# Altium project KlusterLab r2.0.PrjPcb (part 10 of 10)
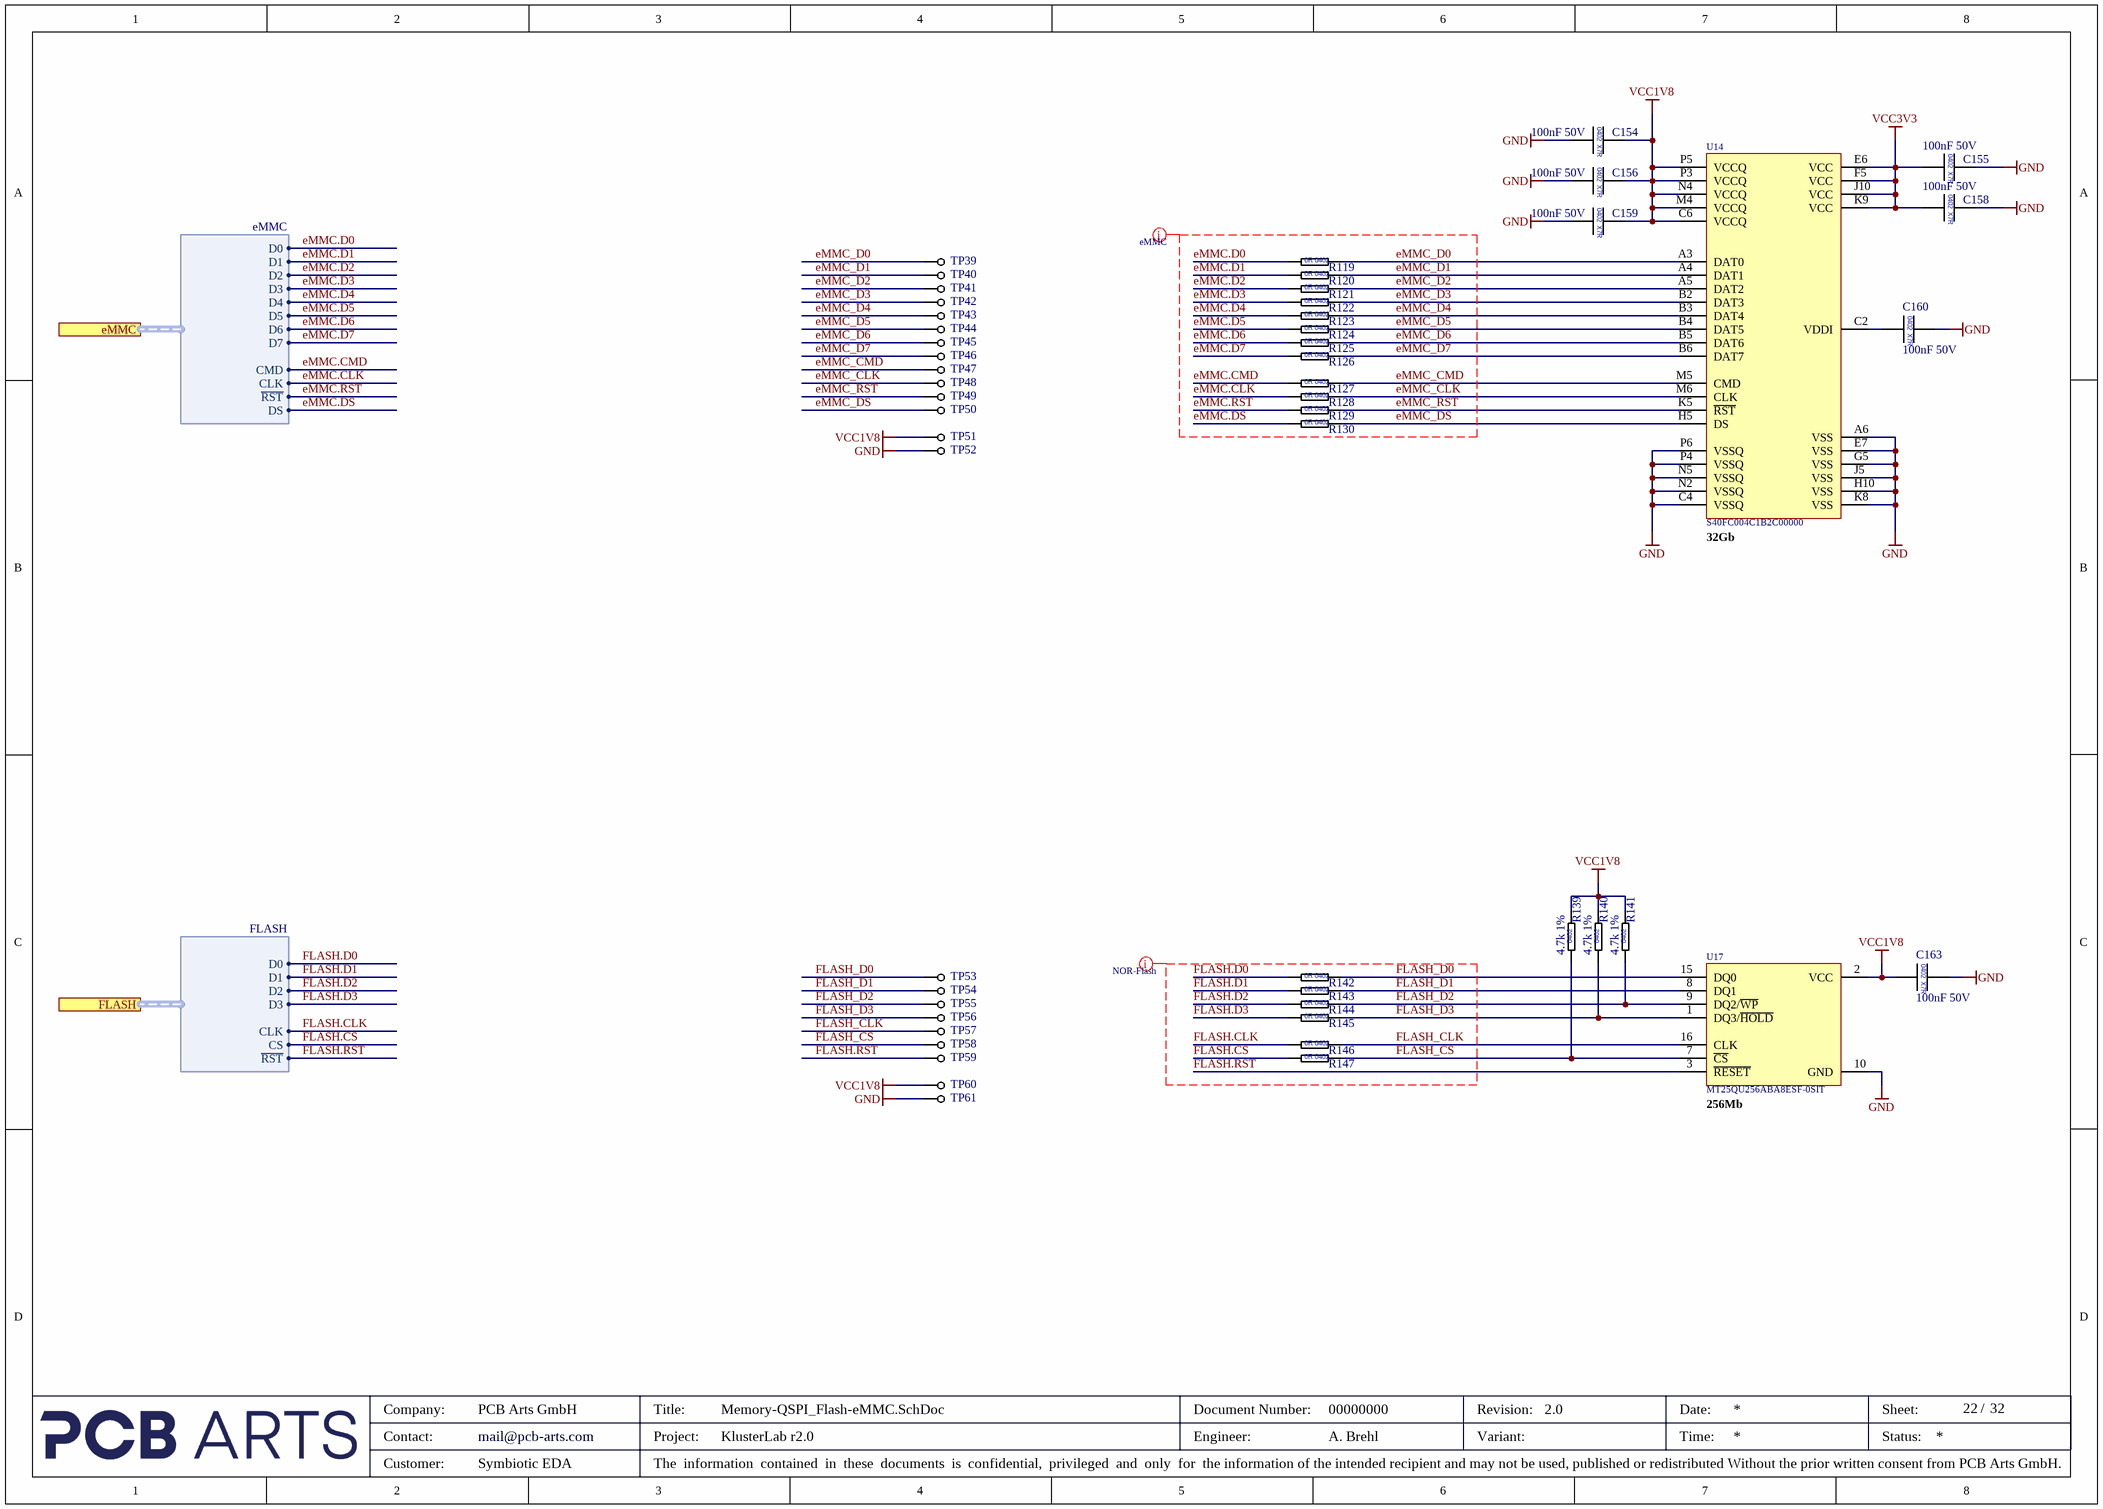
[diagram p31: Memory-QSPI_Flash-eMMC.SchDoc]

## Nets that join several sheets
CM4_3V3: Raspberry Pi CM4 (9 pins), Raspberry Pi CM4_Periphery (C116.1 J12.4 J34.10 J34.12)
GND: Bank 0_Bank 14 (37 pins), Bank 13_Bank 15_Bank 16 (5 pins), DDR3 Memory_Banks 32-33-34 (21 pins), DDR3 Memory_SO-DIMM (85 pins), FPGA_HDMI_IN_OUT (80 pins), HMI (22 pins), Raspberry Pi CM4 (60 pins), SFP+_Connectors (68 pins), SSD M.2_B-Key (16 pins), USB-HUB-MUX (32 pins), Raspberry Pi CM4_Periphery (45 pins), I2C Multiplexer (5 pins), System Clocks (30 pins), FPGA Supply Pins (186 pins), Power-Tree (20 pins), PSU_MGTAVCC_Buck (35 pins), PSU_MGTAVTT_Buck (35 pins), PSU_VCC1V0_FPGA_Buck (67 pins), PSU_VCC1V5_Buck (35 pins), PSU_VCC1V8AUX_Buck (35 pins), PSU_VCC1V8_Buck (35 pins), PSU_VCC2V5_Buck (35 pins), PSU_VCC3V3_Buck (35 pins), PSU_VCC5V_Buck (35 pins), PSU_VCC_CRUVI_ADJ_Buck (26 pins), Cruvi Pinheader (45 pins), Memory-SD_UHS_II (41 pins), Memory-QSPI_Flash-eMMC (21 pins)
MGTAVCC: FPGA Supply Pins (11 pins), PSU_MGTAVCC_Buck (14 pins)
MGTAVTT: MGT Banks 115-116 (R16.2 U1.M5), FPGA Supply Pins (16 pins), PSU_MGTAVTT_Buck (14 pins)
VCC1V0_FPGA: FPGA Supply Pins (36 pins), PSU_VCC1V0_FPGA_Buck (46 pins)
VCC1V5: DDR3 Memory_Banks 32-33-34 (8 pins), DDR3 Memory_SO-DIMM (43 pins), FPGA Supply Pins (27 pins), PSU_VCC1V5_Buck (14 pins)
VCC1V8: Bank 0_Bank 14 (14 pins), HMI (7 pins), SMI Bank 12 (Q5.1 Q6.1 R88.2 R90.2), I2C Multiplexer (8 pins), System Clocks (14 pins), FPGA Supply Pins (23 pins), PSU_VCC1V8_Buck (14 pins), Memory-SD_UHS_II (6 pins), Memory-QSPI_Flash-eMMC (15 pins)
VCC1V8_AUX: FPGA Supply Pins (17 pins), PSU_VCC1V8AUX_Buck (14 pins)
VCC2V5: DDR3 Memory_Banks 32-33-34 (U2.7), PSU_VCC2V5_Buck (14 pins)
VCC3V3: Bank 0_Bank 14 (7 pins), Bank 13_Bank 15_Bank 16 (R283.2 R284.2 R285.2 R286.2), DDR3 Memory_Banks 32-33-34 (C4.1 C5.2 U2.10), DDR3 Memory_SO-DIMM (C15.2 J1.199 R12.2 R13.2), FPGA_HDMI_IN_OUT (26 pins), HMI (J25.2 J28.4 R173.2 R174.2), Raspberry Pi CM4 (R69.2), SFP+_Connectors (40 pins), SMI Bank 12 (R87.2 R89.2), SSD M.2_B-Key (9 pins), USB-HUB-MUX (17 pins), System Clocks (14 pins), FPGA Supply Pins (10 pins), Power-Tree (5 pins), PSU_VCC3V3_Buck (14 pins), PSU_VCC_CRUVI_ADJ_Buck (R324.1), Cruvi Pinheader (J21.4 J21.9 J27.4 J27.9), Memory-SD_UHS_II (5 pins), Memory-QSPI_Flash-eMMC (6 pins)
VCC5V: Bank 13_Bank 15_Bank 16 (5 pins), FPGA_HDMI_IN_OUT (5 pins), Raspberry Pi CM4 (6 pins), USB-HUB-MUX (R73.2), Raspberry Pi CM4_Periphery (5 pins), PSU_VCC5V_Buck (14 pins), PSU_VCC_CRUVI_ADJ_Buck (8 pins), Cruvi Pinheader (J21.60 J27.60), Memory-SD_UHS_II (C531.1 C532.1 U40.3)
VCC12V: Power-Tree (7 pins), PSU_MGTAVCC_Buck (12 pins), PSU_MGTAVTT_Buck (12 pins), PSU_VCC1V0_FPGA_Buck (12 pins), PSU_VCC1V5_Buck (12 pins), PSU_VCC1V8AUX_Buck (12 pins), PSU_VCC1V8_Buck (12 pins), PSU_VCC2V5_Buck (12 pins), PSU_VCC3V3_Buck (12 pins), PSU_VCC5V_Buck (12 pins)
VCC_CRUVI_ADJ: Bank 0_Bank 14 (U11.2), Bank 13_Bank 15_Bank 16 (6 pins), FPGA Supply Pins (18 pins), PSU_VCC_CRUVI_ADJ_Buck (9 pins), Cruvi Pinheader (J21.36 J27.36)
VTTDDR: DDR3 Memory_Banks 32-33-34 (6 pins), DDR3 Memory_SO-DIMM (10 pins)
VTTVREF: DDR3 Memory_Banks 32-33-34 (11 pins), DDR3 Memory_SO-DIMM (C16.1 J1.1 J1.126)
150MHz_REFCLK_N: MGT Banks 115-116 (R18.2 U1.F5), System Clocks (Y5.5)
150MHz_REFCLK_P: MGT Banks 115-116 (R18.1 U1.F6), System Clocks (Y5.4)
156.25MHz_REFCLK_N: MGT Banks 115-116 (R19.2 U1.H5), System Clocks (Y6.5)
156.25MHz_REFCLK_P: MGT Banks 115-116 (R19.1 U1.H6), System Clocks (Y6.4)
200MHz_SYSCLK_N: DDR3 Memory_Banks 32-33-34 (R9.1 U1.AD9), System Clocks (Y4.5)
200MHz_SYSCLK_P: DDR3 Memory_Banks 32-33-34 (R9.2 U1.AC9), System Clocks (Y4.4)
Button_C: Bank 0_Bank 14 (U1.H23), HMI (C418.1 J28.5 R180.1 R185.1)
Button_D: Bank 0_Bank 14 (U1.G22), HMI (C420.1 J28.3 R187.1 R188.1)
Button_L: Bank 0_Bank 14 (U1.H22), HMI (C417.1 J28.1 R179.1 R184.1)
Button_R: Bank 0_Bank 14 (U1.H24), HMI (C419.1 J28.7 R183.1 R186.1)
Button_U: Bank 0_Bank 14 (U1.J24), HMI (C416.1 J28.9 R175.1 R178.1)
CM4_GBE_LED_G: Raspberry Pi CM4 (J7.17), Raspberry Pi CM4_Periphery (R149.1)
CM4_GBE_LED_Y: Raspberry Pi CM4 (J7.15), Raspberry Pi CM4_Periphery (R137.1)
CM4_GBE_MDI0_N: Raspberry Pi CM4 (J7.10), Raspberry Pi CM4_Periphery (T1.13)
CM4_GBE_MDI0_P: Raspberry Pi CM4 (J7.12), Raspberry Pi CM4_Periphery (T1.14)
CM4_GBE_MDI1_N: Raspberry Pi CM4 (J7.6), Raspberry Pi CM4_Periphery (T1.16)
CM4_GBE_MDI1_P: Raspberry Pi CM4 (J7.4), Raspberry Pi CM4_Periphery (T1.17)
CM4_GBE_MDI2_N: Raspberry Pi CM4 (J7.9), Raspberry Pi CM4_Periphery (T1.19)
CM4_GBE_MDI2_P: Raspberry Pi CM4 (J7.11), Raspberry Pi CM4_Periphery (T1.20)
CM4_GBE_MDI3_N: Raspberry Pi CM4 (J7.5), Raspberry Pi CM4_Periphery (T1.22)
CM4_GBE_MDI3_P: Raspberry Pi CM4 (J7.3), Raspberry Pi CM4_Periphery (T1.23)
CM4_GPIO00: Raspberry Pi CM4 (J7.36), SMI Bank 12 (U1.AB25)
CM4_GPIO01: Raspberry Pi CM4 (J7.35), SMI Bank 12 (U1.V23)
CM4_GPIO02: Raspberry Pi CM4 (J7.58), SMI Bank 12 (U1.U26)
CM4_GPIO03: Raspberry Pi CM4 (J7.56), SMI Bank 12 (U1.U24)
CM4_GPIO04: Raspberry Pi CM4 (J7.54), SMI Bank 12 (U1.V26)
CM4_GPIO05: Raspberry Pi CM4 (J7.34), SMI Bank 12 (U1.AB26)
CM4_GPIO06: Raspberry Pi CM4 (J7.30), SMI Bank 12 (U1.AC24)
CM4_GPIO07: Raspberry Pi CM4 (J7.37), SMI Bank 12 (U1.W23)
CM4_GPIO08: Raspberry Pi CM4 (J7.39), SMI Bank 12 (U1.W24)
CM4_GPIO09: Raspberry Pi CM4 (J7.40), SMI Bank 12 (U1.Y26)
CM4_GPIO10: Raspberry Pi CM4 (J7.44), SMI Bank 12 (U1.Y25)
CM4_GPIO11: Raspberry Pi CM4 (J7.38), SMI Bank 12 (U1.AA25)
CM4_GPIO12: Raspberry Pi CM4 (J7.31), SMI Bank 12 (U1.U22)
CM4_GPIO13: Raspberry Pi CM4 (J7.28), SMI Bank 12 (U1.AC26)
CM4_GPIO14: Raspberry Pi CM4 (J7.55), SMI Bank 12 (U1.U25)
CM4_GPIO15: Raspberry Pi CM4 (J7.51), SMI Bank 12 (U1.W26)
CM4_GPIO16: Raspberry Pi CM4 (J7.29), SMI Bank 12 (U1.Y22)
CM4_GPIO17: Raspberry Pi CM4 (J7.50), SMI Bank 12 (U1.W25)
CM4_GPIO18: Raspberry Pi CM4 (J7.49), SMI Bank 12 (U1.Y23)
CM4_GPIO19: Raspberry Pi CM4 (J7.26), SMI Bank 12 (U1.AC23)
CM4_GPIO20: Raspberry Pi CM4 (J7.27), SMI Bank 12 (U1.Y21)
CM4_GPIO21: Raspberry Pi CM4 (J7.25), SMI Bank 12 (U1.W20)
CM4_GPIO22: Raspberry Pi CM4 (J7.46), SMI Bank 12 (U1.AB24)
CM4_GPIO23: Raspberry Pi CM4 (J7.47), SMI Bank 12 (U1.AA23)
CM4_GPIO24: Raspberry Pi CM4 (J7.45), SMI Bank 12 (U1.AA24)
CM4_GPIO25: Raspberry Pi CM4 (J7.41), SMI Bank 12 (U1.AD21)
CM4_GPIO26: Raspberry Pi CM4 (J7.24), SMI Bank 12 (U1.AF24)
CM4_GPIO27: Raspberry Pi CM4 (J7.48), SMI Bank 12 (U1.AF25)
CM4_OTG_ID: Raspberry Pi CM4 (J8.101), USB-HUB-MUX (U10.2)
CM4_USB_N: Raspberry Pi CM4 (J8.103), USB-HUB-MUX (U10.4)
CM4_USB_P: Raspberry Pi CM4 (J8.105), USB-HUB-MUX (U10.3)
CM4_µSD_CLK: Raspberry Pi CM4 (J7.57), Raspberry Pi CM4_Periphery (D20.2 J12.5)
CM4_µSD_CMD: Raspberry Pi CM4 (J7.62), Raspberry Pi CM4_Periphery (D21.2 J12.3)
CM4_µSD_DAT0: Raspberry Pi CM4 (J7.63), Raspberry Pi CM4_Periphery (D16.2 J12.7)
CM4_µSD_DAT1: Raspberry Pi CM4 (J7.67), Raspberry Pi CM4_Periphery (D17.2 J12.8)
CM4_µSD_DAT2: Raspberry Pi CM4 (J7.69), Raspberry Pi CM4_Periphery (D18.2 J12.1)
CM4_µSD_DAT3: Raspberry Pi CM4 (J7.61), Raspberry Pi CM4_Periphery (D19.2 J12.2)
CRUVI_A_0_N: Bank 13_Bank 15_Bank 16 (U1.F8), Cruvi Pinheader (J21.17)
CRUVI_A_0_P: Bank 13_Bank 15_Bank 16 (U1.F9), Cruvi Pinheader (J21.15)
CRUVI_A_1_N: Bank 13_Bank 15_Bank 16 (U1.A14), Cruvi Pinheader (J21.23)
CRUVI_A_1_P: Bank 13_Bank 15_Bank 16 (U1.B14), Cruvi Pinheader (J21.21)
CRUVI_A_2_N: Bank 13_Bank 15_Bank 16 (U1.A15), Cruvi Pinheader (J21.29)
CRUVI_A_2_P: Bank 13_Bank 15_Bank 16 (U1.B15), Cruvi Pinheader (J21.27)
CRUVI_A_3_N: Bank 13_Bank 15_Bank 16 (U1.C13), Cruvi Pinheader (J21.35)
CRUVI_A_3_P: Bank 13_Bank 15_Bank 16 (U1.C14), Cruvi Pinheader (J21.33)
CRUVI_A_4_N: Bank 13_Bank 15_Bank 16 (U1.D13), Cruvi Pinheader (J21.41)
CRUVI_A_4_P: Bank 13_Bank 15_Bank 16 (U1.D14), Cruvi Pinheader (J21.39)
CRUVI_A_5_N: Bank 13_Bank 15_Bank 16 (U1.G14), Cruvi Pinheader (J21.47)
CRUVI_A_5_P: Bank 13_Bank 15_Bank 16 (U1.H14), Cruvi Pinheader (J21.45)
CRUVI_A_6_N: Bank 13_Bank 15_Bank 16 (U1.D10), Cruvi Pinheader (J21.16)
CRUVI_A_6_P: Bank 13_Bank 15_Bank 16 (U1.E10), Cruvi Pinheader (J21.14)
CRUVI_A_7_N: Bank 13_Bank 15_Bank 16 (U1.D11), Cruvi Pinheader (J21.22)
CRUVI_A_7_P: Bank 13_Bank 15_Bank 16 (U1.E11), Cruvi Pinheader (J21.20)
CRUVI_A_8_N: Bank 13_Bank 15_Bank 16 (U1.B11), Cruvi Pinheader (J21.28)
CRUVI_A_8_P: Bank 13_Bank 15_Bank 16 (U1.B12), Cruvi Pinheader (J21.26)
CRUVI_A_9_N: Bank 13_Bank 15_Bank 16 (U1.F13), Cruvi Pinheader (J21.34)
CRUVI_A_9_P: Bank 13_Bank 15_Bank 16 (U1.F14), Cruvi Pinheader (J21.32)
CRUVI_A_10_N: Bank 13_Bank 15_Bank 16 (U1.A12), Cruvi Pinheader (J21.40)
CRUVI_A_10_P: Bank 13_Bank 15_Bank 16 (U1.A13), Cruvi Pinheader (J21.38)
CRUVI_A_11_N: Bank 13_Bank 15_Bank 16 (U1.D8), Cruvi Pinheader (J21.46)
CRUVI_A_11_P: Bank 13_Bank 15_Bank 16 (U1.D9), Cruvi Pinheader (J21.44)
CRUVI_A_DI: Bank 13_Bank 15_Bank 16 (U1.G19), Cruvi Pinheader (J21.51)
CRUVI_A_DO: Bank 13_Bank 15_Bank 16 (U1.D20), Cruvi Pinheader (J21.53)
CRUVI_A_HSI: Bank 13_Bank 15_Bank 16 (U1.F17), Cruvi Pinheader (J21.10)
CRUVI_A_HSIO: Bank 13_Bank 15_Bank 16 (U1.H18), Cruvi Pinheader (J21.2)
CRUVI_A_HSO: Bank 13_Bank 15_Bank 16 (U1.H17), Cruvi Pinheader (J21.6)
CRUVI_A_MODE: Bank 13_Bank 15_Bank 16 (U1.F20), Cruvi Pinheader (J21.57)
CRUVI_A_REFCLK: Bank 13_Bank 15_Bank 16 (U1.E17), Cruvi Pinheader (J21.11)
CRUVI_A_RESET: Bank 13_Bank 15_Bank 16 (U1.H16), Cruvi Pinheader (J21.8)
CRUVI_A_SCK: Bank 13_Bank 15_Bank 16 (U1.G20), Cruvi Pinheader (J21.59)
CRUVI_A_SEL: Bank 13_Bank 15_Bank 16 (U1.E20), Cruvi Pinheader (J21.55)
CRUVI_A_SMB_ALERT: Bank 13_Bank 15_Bank 16 (U1.H19), Cruvi Pinheader (J21.3)
CRUVI_A_SMB_SCL: Bank 13_Bank 15_Bank 16 (R285.1 U1.G17), Cruvi Pinheader (J21.7)
CRUVI_A_SMB_SDA: Bank 13_Bank 15_Bank 16 (R283.1 U1.F19), Cruvi Pinheader (J21.5)
CRUVI_B_0_N: Bank 13_Bank 15_Bank 16 (U1.A8), Cruvi Pinheader (J27.17)
CRUVI_B_0_P: Bank 13_Bank 15_Bank 16 (U1.A9), Cruvi Pinheader (J27.15)
CRUVI_B_1_N: Bank 13_Bank 15_Bank 16 (U1.A10), Cruvi Pinheader (J27.23)
CRUVI_B_1_P: Bank 13_Bank 15_Bank 16 (U1.B10), Cruvi Pinheader (J27.21)
CRUVI_B_2_N: Bank 13_Bank 15_Bank 16 (U1.F12), Cruvi Pinheader (J27.29)
CRUVI_B_2_P: Bank 13_Bank 15_Bank 16 (U1.G12), Cruvi Pinheader (J27.27)
CRUVI_B_3_N: Bank 13_Bank 15_Bank 16 (U1.E12), Cruvi Pinheader (J27.35)
CRUVI_B_3_P: Bank 13_Bank 15_Bank 16 (U1.E13), Cruvi Pinheader (J27.33)
CRUVI_B_4_N: Bank 13_Bank 15_Bank 16 (U1.H13), Cruvi Pinheader (J27.41)
CRUVI_B_4_P: Bank 13_Bank 15_Bank 16 (U1.J13), Cruvi Pinheader (J27.39)
CRUVI_B_5_N: Bank 13_Bank 15_Bank 16 (U1.H11), Cruvi Pinheader (J27.47)
CRUVI_B_5_P: Bank 13_Bank 15_Bank 16 (U1.H12), Cruvi Pinheader (J27.45)
CRUVI_B_6_N: Bank 13_Bank 15_Bank 16 (U1.F10), Cruvi Pinheader (J27.16)
CRUVI_B_6_P: Bank 13_Bank 15_Bank 16 (U1.G11), Cruvi Pinheader (J27.14)
CRUVI_B_7_N: Bank 13_Bank 15_Bank 16 (U1.C11), Cruvi Pinheader (J27.22)
CRUVI_B_7_P: Bank 13_Bank 15_Bank 16 (U1.C12), Cruvi Pinheader (J27.20)
CRUVI_B_8_N: Bank 13_Bank 15_Bank 16 (U1.B9), Cruvi Pinheader (J27.28)
CRUVI_B_8_P: Bank 13_Bank 15_Bank 16 (U1.C9), Cruvi Pinheader (J27.26)
CRUVI_B_9_N: Bank 13_Bank 15_Bank 16 (U1.J10), Cruvi Pinheader (J27.34)
CRUVI_B_9_P: Bank 13_Bank 15_Bank 16 (U1.J11), Cruvi Pinheader (J27.32)
CRUVI_B_10_N: Bank 13_Bank 15_Bank 16 (U1.H8), Cruvi Pinheader (J27.40)
CRUVI_B_10_P: Bank 13_Bank 15_Bank 16 (U1.H9), Cruvi Pinheader (J27.38)
CRUVI_B_11_N: Bank 13_Bank 15_Bank 16 (U1.G9), Cruvi Pinheader (J27.46)
CRUVI_B_11_P: Bank 13_Bank 15_Bank 16 (U1.G10), Cruvi Pinheader (J27.44)
CRUVI_B_DI: Bank 13_Bank 15_Bank 16 (U1.J15), Cruvi Pinheader (J27.51)
CRUVI_B_DO: Bank 13_Bank 15_Bank 16 (U1.C18), Cruvi Pinheader (J27.53)
CRUVI_B_HSI: Bank 13_Bank 15_Bank 16 (U1.G16), Cruvi Pinheader (J27.10)
CRUVI_B_HSIO: Bank 13_Bank 15_Bank 16 (U1.F15), Cruvi Pinheader (J27.2)
CRUVI_B_HSO: Bank 13_Bank 15_Bank 16 (U1.D16), Cruvi Pinheader (J27.6)
CRUVI_B_MODE: Bank 13_Bank 15_Bank 16 (U1.E18), Cruvi Pinheader (J27.57)
CRUVI_B_REFCLK: Bank 13_Bank 15_Bank 16 (U1.E16), Cruvi Pinheader (J27.11)
CRUVI_B_RESET: Bank 13_Bank 15_Bank 16 (U1.D15), Cruvi Pinheader (J27.8)
CRUVI_B_SCK: Bank 13_Bank 15_Bank 16 (U1.D19), Cruvi Pinheader (J27.59)
CRUVI_B_SEL: Bank 13_Bank 15_Bank 16 (U1.D18), Cruvi Pinheader (J27.55)
CRUVI_B_SMB_ALERT: Bank 13_Bank 15_Bank 16 (U1.G15), Cruvi Pinheader (J27.3)
CRUVI_B_SMB_SCL: Bank 13_Bank 15_Bank 16 (R286.1 U1.E15), Cruvi Pinheader (J27.7)
CRUVI_B_SMB_SDA: Bank 13_Bank 15_Bank 16 (R284.1 U1.J16), Cruvi Pinheader (J27.5)
DDR3_A0: DDR3 Memory_Banks 32-33-34 (U1.AF7), DDR3 Memory_SO-DIMM (J1.98)
DDR3_A1: DDR3 Memory_Banks 32-33-34 (U1.AD8), DDR3 Memory_SO-DIMM (J1.97)
DDR3_A2: DDR3 Memory_Banks 32-33-34 (U1.AB10), DDR3 Memory_SO-DIMM (J1.96)
DDR3_A3: DDR3 Memory_Banks 32-33-34 (U1.AC8), DDR3 Memory_SO-DIMM (J1.95)
DDR3_A4: DDR3 Memory_Banks 32-33-34 (U1.W11), DDR3 Memory_SO-DIMM (J1.92)
DDR3_A5: DDR3 Memory_Banks 32-33-34 (U1.AA12), DDR3 Memory_SO-DIMM (J1.91)
DDR3_A6: DDR3 Memory_Banks 32-33-34 (U1.AC12), DDR3 Memory_SO-DIMM (J1.90)
DDR3_A7: DDR3 Memory_Banks 32-33-34 (U1.AD13), DDR3 Memory_SO-DIMM (J1.86)
DDR3_A8: DDR3 Memory_Banks 32-33-34 (U1.AB12), DDR3 Memory_SO-DIMM (J1.89)
DDR3_A9: DDR3 Memory_Banks 32-33-34 (U1.AD11), DDR3 Memory_SO-DIMM (J1.85)
DDR3_A10: DDR3 Memory_Banks 32-33-34 (U1.AE7), DDR3 Memory_SO-DIMM (J1.107)
DDR3_A11: DDR3 Memory_Banks 32-33-34 (U1.Y11), DDR3 Memory_SO-DIMM (J1.84)
DDR3_A12: DDR3 Memory_Banks 32-33-34 (U1.AA13), DDR3 Memory_SO-DIMM (J1.83)
DDR3_A13: DDR3 Memory_Banks 32-33-34 (U1.AB7), DDR3 Memory_SO-DIMM (J1.119)
DDR3_A14: DDR3 Memory_Banks 32-33-34 (U1.Y13), DDR3 Memory_SO-DIMM (J1.80)
DDR3_A15: DDR3 Memory_Banks 32-33-34 (U1.Y12), DDR3 Memory_SO-DIMM (J1.78)
DDR3_BA0: DDR3 Memory_Banks 32-33-34 (U1.AC7), DDR3 Memory_SO-DIMM (J1.109)
DDR3_BA1: DDR3 Memory_Banks 32-33-34 (U1.V8), DDR3 Memory_SO-DIMM (J1.108)
DDR3_BA2: DDR3 Memory_Banks 32-33-34 (U1.AC13), DDR3 Memory_SO-DIMM (J1.79)
DDR3_~{CAS}: DDR3 Memory_Banks 32-33-34 (U1.AA7), DDR3 Memory_SO-DIMM (J1.115)
DDR3_CKE0: DDR3 Memory_Banks 32-33-34 (U1.Y10), DDR3 Memory_SO-DIMM (J1.73 R10.2)
DDR3_CKE1: DDR3 Memory_Banks 32-33-34 (U1.W9), DDR3 Memory_SO-DIMM (J1.74 R11.2)
DDR3_CLK0_N: DDR3 Memory_Banks 32-33-34 (U1.AC11), DDR3 Memory_SO-DIMM (J1.103)
DDR3_CLK0_P: DDR3 Memory_Banks 32-33-34 (U1.AB11), DDR3 Memory_SO-DIMM (J1.101)
DDR3_CLK1_N: DDR3 Memory_Banks 32-33-34 (U1.AB9), DDR3 Memory_SO-DIMM (J1.104)
DDR3_CLK1_P: DDR3 Memory_Banks 32-33-34 (U1.AA9), DDR3 Memory_SO-DIMM (J1.102)
DDR3_D0: DDR3 Memory_Banks 32-33-34 (U1.AB17), DDR3 Memory_SO-DIMM (J1.5)
DDR3_D1: DDR3 Memory_Banks 32-33-34 (U1.AC18), DDR3 Memory_SO-DIMM (J1.7)
DDR3_D2: DDR3 Memory_Banks 32-33-34 (U1.AC17), DDR3 Memory_SO-DIMM (J1.15)
DDR3_D3: DDR3 Memory_Banks 32-33-34 (U1.AD19), DDR3 Memory_SO-DIMM (J1.17)
DDR3_D4: DDR3 Memory_Banks 32-33-34 (U1.AA19), DDR3 Memory_SO-DIMM (J1.4)
DDR3_D5: DDR3 Memory_Banks 32-33-34 (U1.AA20), DDR3 Memory_SO-DIMM (J1.6)
DDR3_D6: DDR3 Memory_Banks 32-33-34 (U1.AD18), DDR3 Memory_SO-DIMM (J1.16)
DDR3_D7: DDR3 Memory_Banks 32-33-34 (U1.AC16), DDR3 Memory_SO-DIMM (J1.18)
DDR3_D8: DDR3 Memory_Banks 32-33-34 (U1.V16), DDR3 Memory_SO-DIMM (J1.21)
DDR3_D9: DDR3 Memory_Banks 32-33-34 (U1.V18), DDR3 Memory_SO-DIMM (J1.23)
DDR3_D10: DDR3 Memory_Banks 32-33-34 (U1.AB20), DDR3 Memory_SO-DIMM (J1.33)
DDR3_D11: DDR3 Memory_Banks 32-33-34 (U1.AB19), DDR3 Memory_SO-DIMM (J1.35)
DDR3_D12: DDR3 Memory_Banks 32-33-34 (U1.W15), DDR3 Memory_SO-DIMM (J1.22)
DDR3_D13: DDR3 Memory_Banks 32-33-34 (U1.V19), DDR3 Memory_SO-DIMM (J1.24)
DDR3_D14: DDR3 Memory_Banks 32-33-34 (U1.W16), DDR3 Memory_SO-DIMM (J1.34)
DDR3_D15: DDR3 Memory_Banks 32-33-34 (U1.Y17), DDR3 Memory_SO-DIMM (J1.36)
DDR3_D16: DDR3 Memory_Banks 32-33-34 (U1.AF19), DDR3 Memory_SO-DIMM (J1.39)
DDR3_D17: DDR3 Memory_Banks 32-33-34 (U1.AE17), DDR3 Memory_SO-DIMM (J1.41)
DDR3_D18: DDR3 Memory_Banks 32-33-34 (U1.AE15), DDR3 Memory_SO-DIMM (J1.51)
DDR3_D19: DDR3 Memory_Banks 32-33-34 (U1.AF15), DDR3 Memory_SO-DIMM (J1.53)
DDR3_D20: DDR3 Memory_Banks 32-33-34 (U1.AF20), DDR3 Memory_SO-DIMM (J1.40)
DDR3_D21: DDR3 Memory_Banks 32-33-34 (U1.AD16), DDR3 Memory_SO-DIMM (J1.42)
DDR3_D22: DDR3 Memory_Banks 32-33-34 (U1.AD15), DDR3 Memory_SO-DIMM (J1.50)
DDR3_D23: DDR3 Memory_Banks 32-33-34 (U1.AF14), DDR3 Memory_SO-DIMM (J1.52)
DDR3_D24: DDR3 Memory_Banks 32-33-34 (U1.AA15), DDR3 Memory_SO-DIMM (J1.57)
DDR3_D25: DDR3 Memory_Banks 32-33-34 (U1.AB16), DDR3 Memory_SO-DIMM (J1.59)
DDR3_D26: DDR3 Memory_Banks 32-33-34 (U1.AD14), DDR3 Memory_SO-DIMM (J1.67)
DDR3_D27: DDR3 Memory_Banks 32-33-34 (U1.AB14), DDR3 Memory_SO-DIMM (J1.69)
DDR3_D28: DDR3 Memory_Banks 32-33-34 (U1.AA18), DDR3 Memory_SO-DIMM (J1.56)
DDR3_D29: DDR3 Memory_Banks 32-33-34 (U1.AA17), DDR3 Memory_SO-DIMM (J1.58)
DDR3_D30: DDR3 Memory_Banks 32-33-34 (U1.AB15), DDR3 Memory_SO-DIMM (J1.68)
DDR3_D31: DDR3 Memory_Banks 32-33-34 (U1.AC14), DDR3 Memory_SO-DIMM (J1.70)
DDR3_D32: DDR3 Memory_Banks 32-33-34 (U1.AD6), DDR3 Memory_SO-DIMM (J1.129)
DDR3_D33: DDR3 Memory_Banks 32-33-34 (U1.AC6), DDR3 Memory_SO-DIMM (J1.131)
DDR3_D34: DDR3 Memory_Banks 32-33-34 (U1.AC3), DDR3 Memory_SO-DIMM (J1.141)
DDR3_D35: DDR3 Memory_Banks 32-33-34 (U1.AB4), DDR3 Memory_SO-DIMM (J1.143)
DDR3_D36: DDR3 Memory_Banks 32-33-34 (U1.AB6), DDR3 Memory_SO-DIMM (J1.130)
DDR3_D37: DDR3 Memory_Banks 32-33-34 (U1.Y6), DDR3 Memory_SO-DIMM (J1.132)
DDR3_D38: DDR3 Memory_Banks 32-33-34 (U1.Y5), DDR3 Memory_SO-DIMM (J1.140)
DDR3_D39: DDR3 Memory_Banks 32-33-34 (U1.AA4), DDR3 Memory_SO-DIMM (J1.142)
DDR3_D40: DDR3 Memory_Banks 32-33-34 (U1.AF3), DDR3 Memory_SO-DIMM (J1.147)
DDR3_D41: DDR3 Memory_Banks 32-33-34 (U1.AE3), DDR3 Memory_SO-DIMM (J1.149)
DDR3_D42: DDR3 Memory_Banks 32-33-34 (U1.AE2), DDR3 Memory_SO-DIMM (J1.157)
DDR3_D43: DDR3 Memory_Banks 32-33-34 (U1.AE1), DDR3 Memory_SO-DIMM (J1.159)
DDR3_D44: DDR3 Memory_Banks 32-33-34 (U1.AE6), DDR3 Memory_SO-DIMM (J1.146)
DDR3_D45: DDR3 Memory_Banks 32-33-34 (U1.AE5), DDR3 Memory_SO-DIMM (J1.148)
DDR3_D46: DDR3 Memory_Banks 32-33-34 (U1.AD4), DDR3 Memory_SO-DIMM (J1.158)
DDR3_D47: DDR3 Memory_Banks 32-33-34 (U1.AD1), DDR3 Memory_SO-DIMM (J1.160)
DDR3_D48: DDR3 Memory_Banks 32-33-34 (U1.W3), DDR3 Memory_SO-DIMM (J1.163)
DDR3_D49: DDR3 Memory_Banks 32-33-34 (U1.V4), DDR3 Memory_SO-DIMM (J1.165)
DDR3_D50: DDR3 Memory_Banks 32-33-34 (U1.U2), DDR3 Memory_SO-DIMM (J1.175)
DDR3_D51: DDR3 Memory_Banks 32-33-34 (U1.U5), DDR3 Memory_SO-DIMM (J1.177)
DDR3_D52: DDR3 Memory_Banks 32-33-34 (U1.V6), DDR3 Memory_SO-DIMM (J1.164)
DDR3_D53: DDR3 Memory_Banks 32-33-34 (U1.V3), DDR3 Memory_SO-DIMM (J1.166)
DDR3_D54: DDR3 Memory_Banks 32-33-34 (U1.U1), DDR3 Memory_SO-DIMM (J1.174)
DDR3_D55: DDR3 Memory_Banks 32-33-34 (U1.U6), DDR3 Memory_SO-DIMM (J1.176)
DDR3_D56: DDR3 Memory_Banks 32-33-34 (U1.AB2), DDR3 Memory_SO-DIMM (J1.181)
DDR3_D57: DDR3 Memory_Banks 32-33-34 (U1.AA3), DDR3 Memory_SO-DIMM (J1.183)
DDR3_D58: DDR3 Memory_Banks 32-33-34 (U1.W1), DDR3 Memory_SO-DIMM (J1.191)
DDR3_D59: DDR3 Memory_Banks 32-33-34 (U1.V2), DDR3 Memory_SO-DIMM (J1.193)
DDR3_D60: DDR3 Memory_Banks 32-33-34 (U1.AC2), DDR3 Memory_SO-DIMM (J1.180)
DDR3_D61: DDR3 Memory_Banks 32-33-34 (U1.Y3), DDR3 Memory_SO-DIMM (J1.182)
DDR3_D62: DDR3 Memory_Banks 32-33-34 (U1.Y2), DDR3 Memory_SO-DIMM (J1.192)
DDR3_D63: DDR3 Memory_Banks 32-33-34 (U1.V1), DDR3 Memory_SO-DIMM (J1.194)
DDR3_DM0: DDR3 Memory_Banks 32-33-34 (U1.AC19), DDR3 Memory_SO-DIMM (J1.11)
DDR3_DM1: DDR3 Memory_Banks 32-33-34 (U1.V17), DDR3 Memory_SO-DIMM (J1.28)
DDR3_DM2: DDR3 Memory_Banks 32-33-34 (U1.AF17), DDR3 Memory_SO-DIMM (J1.46)
DDR3_DM3: DDR3 Memory_Banks 32-33-34 (U1.AA14), DDR3 Memory_SO-DIMM (J1.63)
DDR3_DM4: DDR3 Memory_Banks 32-33-34 (U1.AC4), DDR3 Memory_SO-DIMM (J1.136)
DDR3_DM5: DDR3 Memory_Banks 32-33-34 (U1.AF2), DDR3 Memory_SO-DIMM (J1.153)
DDR3_DM6: DDR3 Memory_Banks 32-33-34 (U1.U7), DDR3 Memory_SO-DIMM (J1.170)
DDR3_DM7: DDR3 Memory_Banks 32-33-34 (U1.Y1), DDR3 Memory_SO-DIMM (J1.187)
DDR3_DQS0_N: DDR3 Memory_Banks 32-33-34 (U1.AE20), DDR3 Memory_SO-DIMM (J1.10)
DDR3_DQS0_P: DDR3 Memory_Banks 32-33-34 (U1.AD20), DDR3 Memory_SO-DIMM (J1.12)
DDR3_DQS1_N: DDR3 Memory_Banks 32-33-34 (U1.W19), DDR3 Memory_SO-DIMM (J1.27)
DDR3_DQS1_P: DDR3 Memory_Banks 32-33-34 (U1.W18), DDR3 Memory_SO-DIMM (J1.29)
DDR3_DQS2_N: DDR3 Memory_Banks 32-33-34 (U1.AF18), DDR3 Memory_SO-DIMM (J1.45)
DDR3_DQS2_P: DDR3 Memory_Banks 32-33-34 (U1.AE18), DDR3 Memory_SO-DIMM (J1.47)
DDR3_DQS3_N: DDR3 Memory_Banks 32-33-34 (U1.Y16), DDR3 Memory_SO-DIMM (J1.62)
DDR3_DQS3_P: DDR3 Memory_Banks 32-33-34 (U1.Y15), DDR3 Memory_SO-DIMM (J1.64)
DDR3_DQS4_N: DDR3 Memory_Banks 32-33-34 (U1.AB5), DDR3 Memory_SO-DIMM (J1.135)
DDR3_DQS4_P: DDR3 Memory_Banks 32-33-34 (U1.AA5), DDR3 Memory_SO-DIMM (J1.137)
DDR3_DQS5_N: DDR3 Memory_Banks 32-33-34 (U1.AF4), DDR3 Memory_SO-DIMM (J1.152)
DDR3_DQS5_P: DDR3 Memory_Banks 32-33-34 (U1.AF5), DDR3 Memory_SO-DIMM (J1.154)
DDR3_DQS6_N: DDR3 Memory_Banks 32-33-34 (U1.W5), DDR3 Memory_SO-DIMM (J1.169)
DDR3_DQS6_P: DDR3 Memory_Banks 32-33-34 (U1.W6), DDR3 Memory_SO-DIMM (J1.171)
DDR3_DQS7_N: DDR3 Memory_Banks 32-33-34 (U1.AC1), DDR3 Memory_SO-DIMM (J1.186)
DDR3_DQS7_P: DDR3 Memory_Banks 32-33-34 (U1.AB1), DDR3 Memory_SO-DIMM (J1.188)
DDR3_~{EVENT}: DDR3 Memory_Banks 32-33-34 (U1.W10), DDR3 Memory_SO-DIMM (J1.198 R14.1)
DDR3_ODT0: DDR3 Memory_Banks 32-33-34 (U1.AA8), DDR3 Memory_SO-DIMM (J1.116)
DDR3_ODT1: DDR3 Memory_Banks 32-33-34 (U1.V9), DDR3 Memory_SO-DIMM (J1.120)
DDR3_~{RAS}: DDR3 Memory_Banks 32-33-34 (U1.AA10), DDR3 Memory_SO-DIMM (J1.110)
DDR3_~{RESET}: DDR3 Memory_Banks 32-33-34 (U1.V11), DDR3 Memory_SO-DIMM (J1.30 R15.1)
DDR3_~{S0}: DDR3 Memory_Banks 32-33-34 (U1.Y8), DDR3 Memory_SO-DIMM (J1.114)
DDR3_~{S1}: DDR3 Memory_Banks 32-33-34 (U1.V7), DDR3 Memory_SO-DIMM (J1.121)
DDR3_SCL: DDR3 Memory_SO-DIMM (J1.202 R13.1), I2C Multiplexer (U22.4)
DDR3_SDA: DDR3 Memory_SO-DIMM (J1.200 R12.1), I2C Multiplexer (U22.3)
DDR3_~{WE}: DDR3 Memory_Banks 32-33-34 (U1.Y7), DDR3 Memory_SO-DIMM (J1.113)
eMMC.CLK: Bank 0_Bank 14 (U1.D23), Memory-QSPI_Flash-eMMC (R128.1)
eMMC.CMD: Bank 0_Bank 14 (U1.E22), Memory-QSPI_Flash-eMMC (R127.1)
eMMC.D0: Bank 0_Bank 14 (U1.A24), Memory-QSPI_Flash-eMMC (R119.1)
eMMC.D1: Bank 0_Bank 14 (U1.A23), Memory-QSPI_Flash-eMMC (R120.1)
eMMC.D2: Bank 0_Bank 14 (U1.C26), Memory-QSPI_Flash-eMMC (R121.1)
eMMC.D3: Bank 0_Bank 14 (U1.D21), Memory-QSPI_Flash-eMMC (R122.1)
eMMC.D4: Bank 0_Bank 14 (U1.C24), Memory-QSPI_Flash-eMMC (R123.1)
eMMC.D5: Bank 0_Bank 14 (U1.C21), Memory-QSPI_Flash-eMMC (R124.1)
eMMC.D6: Bank 0_Bank 14 (U1.D24), Memory-QSPI_Flash-eMMC (R125.1)
eMMC.D7: Bank 0_Bank 14 (U1.B21), Memory-QSPI_Flash-eMMC (R126.1)
eMMC.DS: Bank 0_Bank 14 (U1.F22), Memory-QSPI_Flash-eMMC (R130.1)
eMMC.~{RST}: Bank 0_Bank 14 (U1.D26), Memory-QSPI_Flash-eMMC (R129.1)
FLASH.~{CS}: Bank 0_Bank 14 (U1.C23), Memory-QSPI_Flash-eMMC (R147.1)
FLASH.CLK: Bank 0_Bank 14 (R117.2 U1.C8), Memory-QSPI_Flash-eMMC (R146.1)
FLASH.D0: Bank 0_Bank 14 (U1.B24), Memory-QSPI_Flash-eMMC (R142.1)
FLASH.D1: Bank 0_Bank 14 (U1.A25), Memory-QSPI_Flash-eMMC (R143.1)
FLASH.D2: Bank 0_Bank 14 (U1.B22), Memory-QSPI_Flash-eMMC (R144.1)
FLASH.D3: Bank 0_Bank 14 (U1.A22), Memory-QSPI_Flash-eMMC (R145.1)
FLASH.~{RST}: Bank 0_Bank 14 (R118.1), Memory-QSPI_Flash-eMMC (TP59.1 U17.3)
HDMI_CM4_CEC: Raspberry Pi CM4 (J8.151), Raspberry Pi CM4_Periphery (D12.2 J11.13)
HDMI_CM4_CLOCK_N: Raspberry Pi CM4 (J8.190), Raspberry Pi CM4_Periphery (D11.2 J11.12)
HDMI_CM4_CLOCK_P: Raspberry Pi CM4 (J8.188), Raspberry Pi CM4_Periphery (D10.2 J11.10)
HDMI_CM4_DATA0_N: Raspberry Pi CM4 (J8.184), Raspberry Pi CM4_Periphery (D9.2 J11.9)
HDMI_CM4_DATA0_P: Raspberry Pi CM4 (J8.182), Raspberry Pi CM4_Periphery (D8.2 J11.7)
HDMI_CM4_DATA1_N: Raspberry Pi CM4 (J8.178), Raspberry Pi CM4_Periphery (D7.2 J11.6)
HDMI_CM4_DATA1_P: Raspberry Pi CM4 (J8.176), Raspberry Pi CM4_Periphery (D6.2 J11.4)
HDMI_CM4_DATA2_N: Raspberry Pi CM4 (J8.172), Raspberry Pi CM4_Periphery (D5.2 J11.3)
HDMI_CM4_DATA2_P: Raspberry Pi CM4 (J8.170), Raspberry Pi CM4_Periphery (D4.2 J11.1)
HDMI_CM4_HPD: Raspberry Pi CM4 (J8.153), Raspberry Pi CM4_Periphery (D15.2 J11.19)
HDMI_CM4_SCL: Raspberry Pi CM4 (J8.200), Raspberry Pi CM4_Periphery (D13.2 J11.15)
HDMI_CM4_SDA: Raspberry Pi CM4 (J8.199), Raspberry Pi CM4_Periphery (D14.2 J11.16)
HDMI_FPGA_RX0_N: Bank 13_Bank 15_Bank 16 (U1.N24), FPGA_HDMI_IN_OUT (U21.14)
HDMI_FPGA_RX0_P: Bank 13_Bank 15_Bank 16 (U1.P24), FPGA_HDMI_IN_OUT (U21.15)
HDMI_FPGA_RX1_N: Bank 13_Bank 15_Bank 16 (U1.P26), FPGA_HDMI_IN_OUT (U21.17)
HDMI_FPGA_RX1_P: Bank 13_Bank 15_Bank 16 (U1.R26), FPGA_HDMI_IN_OUT (U21.18)
HDMI_FPGA_RX2_N: Bank 13_Bank 15_Bank 16 (U1.P25), FPGA_HDMI_IN_OUT (U21.19)
HDMI_FPGA_RX2_P: Bank 13_Bank 15_Bank 16 (U1.R25), FPGA_HDMI_IN_OUT (U21.20)
HDMI_FPGA_RXC_N: Bank 13_Bank 15_Bank 16 (U1.N23), FPGA_HDMI_IN_OUT (U21.11)
HDMI_FPGA_RXC_P: Bank 13_Bank 15_Bank 16 (U1.P23), FPGA_HDMI_IN_OUT (U21.12)
HDMI_FPGA_RXCEC: Bank 13_Bank 15_Bank 16 (U1.L24), FPGA_HDMI_IN_OUT (U21.31)
HDMI_FPGA_RXHPD: Bank 13_Bank 15_Bank 16 (U1.M22), FPGA_HDMI_IN_OUT (Q10.1 R170.2)
HDMI_FPGA_RXSCL: Bank 13_Bank 15_Bank 16 (U1.M24), FPGA_HDMI_IN_OUT (R168.1 U21.35)
HDMI_FPGA_RXSDA: Bank 13_Bank 15_Bank 16 (U1.M21), FPGA_HDMI_IN_OUT (R169.1 U21.34)
HDMI_FPGA_TX0_N: Bank 13_Bank 15_Bank 16 (U1.P20), FPGA_HDMI_IN_OUT (U19.35)
HDMI_FPGA_TX0_P: Bank 13_Bank 15_Bank 16 (U1.P19), FPGA_HDMI_IN_OUT (U19.36)
HDMI_FPGA_TX1_N: Bank 13_Bank 15_Bank 16 (U1.K26), FPGA_HDMI_IN_OUT (U19.38)
HDMI_FPGA_TX1_P: Bank 13_Bank 15_Bank 16 (U1.K25), FPGA_HDMI_IN_OUT (U19.39)
HDMI_FPGA_TX2_N: Bank 13_Bank 15_Bank 16 (U1.L25), FPGA_HDMI_IN_OUT (U19.1)
HDMI_FPGA_TX2_P: Bank 13_Bank 15_Bank 16 (U1.M25), FPGA_HDMI_IN_OUT (U19.2)
HDMI_FPGA_TXC_N: Bank 13_Bank 15_Bank 16 (U1.M20), FPGA_HDMI_IN_OUT (U19.32)
HDMI_FPGA_TXC_P: Bank 13_Bank 15_Bank 16 (U1.N19), FPGA_HDMI_IN_OUT (U19.33)
HDMI_FPGA_TXCEC: Bank 13_Bank 15_Bank 16 (U1.N26), FPGA_HDMI_IN_OUT (D44.2 J23.13 R151.2)
HDMI_FPGA_TXHPD: Bank 13_Bank 15_Bank 16 (U1.M26), FPGA_HDMI_IN_OUT (Q9.3 R155.1)
HDMI_FPGA_TXSCL: FPGA_HDMI_IN_OUT (R158.2 U19.29), I2C Multiplexer (U22.2)
HDMI_FPGA_TXSDA: FPGA_HDMI_IN_OUT (R159.2 U19.28), I2C Multiplexer (U22.1)
I2C_OLED_SCL: HMI (J25.3 J28.6 R173.1), I2C Multiplexer (U22.6)
I2C_OLED_SDA: HMI (J25.4 J28.8 R174.1), I2C Multiplexer (U22.5)
JTAG_USB_D_N: Bank 0_Bank 14 (U11.16), USB-HUB-MUX (U9.4)
JTAG_USB_D_P: Bank 0_Bank 14 (U11.17), USB-HUB-MUX (U9.3)
Main_I2C_MUX_RST: SMI Bank 12 (U1.W21), I2C Multiplexer (R199.1 U22.24)
Main_I2C_SCL: SMI Bank 12 (U1.V21), I2C Multiplexer (R198.1 U22.19)
Main_I2C_SDA: SMI Bank 12 (U1.AE21), I2C Multiplexer (R197.1 U22.20)
MGTX115_RX0_N: MGT Banks 115-116 (U1.R3), SFP+_Connectors (J2.12)
MGTX115_RX0_P: MGT Banks 115-116 (U1.R4), SFP+_Connectors (J2.13)
MGTX115_RX1_N: MGT Banks 115-116 (U1.N3), SFP+_Connectors (J3.12)
MGTX115_RX1_P: MGT Banks 115-116 (U1.N4), SFP+_Connectors (J3.13)
MGTX115_RX2_N: MGT Banks 115-116 (U1.L3), SFP+_Connectors (J4.12)
MGTX115_RX2_P: MGT Banks 115-116 (U1.L4), SFP+_Connectors (J4.13)
MGTX115_RX3_N: MGT Banks 115-116 (U1.J3), SFP+_Connectors (J5.12)
MGTX115_RX3_P: MGT Banks 115-116 (U1.J4), SFP+_Connectors (J5.13)
MGTX115_TX0_N: MGT Banks 115-116 (U1.P1), SFP+_Connectors (J2.19)
MGTX115_TX0_P: MGT Banks 115-116 (U1.P2), SFP+_Connectors (J2.18)
MGTX115_TX1_N: MGT Banks 115-116 (U1.M1), SFP+_Connectors (J3.19)
MGTX115_TX1_P: MGT Banks 115-116 (U1.M2), SFP+_Connectors (J3.18)
MGTX115_TX2_N: MGT Banks 115-116 (U1.K1), SFP+_Connectors (J4.19)
MGTX115_TX2_P: MGT Banks 115-116 (U1.K2), SFP+_Connectors (J4.18)
MGTX115_TX3_N: MGT Banks 115-116 (U1.H1), SFP+_Connectors (J5.19)
MGTX115_TX3_P: MGT Banks 115-116 (U1.H2), SFP+_Connectors (J5.18)
PCIe_PERST: Bank 13_Bank 15_Bank 16 (U1.P18), Raspberry Pi CM4 (J8.109)
PCIe_REFCLK_N: MGT Banks 115-116 (U1.D5), Raspberry Pi CM4 (J8.112)
PCIe_REFCLK_P: MGT Banks 115-116 (U1.D6), Raspberry Pi CM4 (J8.110)
PCIe_RX0_N: MGT Banks 115-116 (U1.B5), Raspberry Pi CM4 (J8.124)
PCIe_RX0_P: MGT Banks 115-116 (U1.B6), Raspberry Pi CM4 (J8.122)
PCIe_TX0_N: MGT Banks 115-116 (C82.2), Raspberry Pi CM4 (J8.118)
PCIe_TX0_P: MGT Banks 115-116 (C81.2), Raspberry Pi CM4 (J8.116)
PI_~{EXTRST}: Bank 13_Bank 15_Bank 16 (U1.U16), Raspberry Pi CM4 (J7.100)
PSU_CTRL.1V0_FPGA_EN: Power-Tree (NT8.1), PSU_VCC1V0_FPGA_Buck (U13.8)
PSU_CTRL.1V0_FPGA_PG: Power-Tree (NT4.2), PSU_VCC1V0_FPGA_Buck (R254.2 U13.9)
PSU_CTRL.1V0_MGTAVCC_EN: Power-Tree (NT7.1), PSU_MGTAVCC_Buck (U33.8)
PSU_CTRL.1V0_MGTAVCC_PG: Power-Tree (NT6.2), PSU_MGTAVCC_Buck (R299.2 U33.9)
PSU_CTRL.1V2_MGTAVTT_EN: Power-Tree (NT6.1), PSU_MGTAVTT_Buck (U32.8)
PSU_CTRL.1V2_MGTAVTT_PG: Power-Tree (5 pins), PSU_MGTAVTT_Buck (R251.2 U32.9)
PSU_CTRL.1V5_EN: Power-Tree (NT5.1), PSU_VCC1V5_Buck (U31.8)
PSU_CTRL.1V8_EN: Power-Tree (NT3.1), PSU_VCC1V8_Buck (U29.8)
PSU_CTRL.1V8AUX_EN: Power-Tree (NT4.1), PSU_VCC1V8AUX_Buck (U30.8)
PSU_CTRL.1V8AUX_PG: Power-Tree (NT7.2), PSU_VCC1V8AUX_Buck (R235.2 U30.9)
PSU_CTRL.2V5_EN: Power-Tree (NT2.1), PSU_VCC2V5_Buck (U34.8)
PSU_CTRL.3V3_EN: Power-Tree (NT1.1), PSU_VCC3V3_Buck (U35.8)
PSU_CTRL.5V0_EN: Power-Tree (R228.1 R229.2), PSU_VCC5V_Buck (U28.8)
PSU_CTRL.5V0_PG: Power-Tree (NT8.2), PSU_VCC5V_Buck (R214.2 U28.9)
PSU_CTRL.VCC_CRUVI_EN: Power-Tree (NT9.1), PSU_VCC_CRUVI_ADJ_Buck (U37.3)
REC_CLOCK_C_N: Bank 13_Bank 15_Bank 16 (U1.P21), System Clocks (C191.2 R206.2 R231.2)
REC_CLOCK_C_P: Bank 13_Bank 15_Bank 16 (U1.R21), System Clocks (C189.2 R206.1 R230.2)
SATA_RX_N: MGT Banks 115-116 (C86.2), SSD M.2_B-Key (J6.43)
SATA_RX_P: MGT Banks 115-116 (C85.2), SSD M.2_B-Key (J6.41)
SATA_TX_N: MGT Banks 115-116 (C84.2), SSD M.2_B-Key (J6.47)
SATA_TX_P: MGT Banks 115-116 (C83.2), SSD M.2_B-Key (J6.49)
SDCARD.CD: SMI Bank 12 (U1.AC22), Memory-SD_UHS_II (D32.5 J19.8 R337.2)
SDCARD.CLK: SMI Bank 12 (U1.AE22), Memory-SD_UHS_II (U38.5)
SDCARD.CLK_FB: SMI Bank 12 (U1.AA22), Memory-SD_UHS_II (U38.6)
SDCARD.CMD: SMI Bank 12 (U1.AB22), Memory-SD_UHS_II (U38.16)
SDCARD.DAT0: SMI Bank 12 (U1.AD24), Memory-SD_UHS_II (U38.3)
SDCARD.DAT1: SMI Bank 12 (U1.AC21), Memory-SD_UHS_II (U38.4)
SDCARD.DAT2: SMI Bank 12 (U1.AD23), Memory-SD_UHS_II (U38.1)
SDCARD.DAT3: SMI Bank 12 (U1.AB21), Memory-SD_UHS_II (U38.2)
SDCARD.EN: SMI Bank 12 (U1.AF23), Memory-SD_UHS_II (R343.1 U40.5 U41.4)
SDCARD.MUX-SEL: SMI Bank 12 (U1.AE23), Memory-SD_UHS_II (R336.1 U39.10)
SDCARD.PERX_N: MGT Banks 115-116 (C523.2), Memory-SD_UHS_II (D83.1 J19.13)
SDCARD.PERX_P: MGT Banks 115-116 (C522.2), Memory-SD_UHS_II (D83.9 J19.15)
SDCARD.PETX_N: MGT Banks 115-116 (C521.2), Memory-SD_UHS_II (D32.8 J19.6)
SDCARD.PETX_P: MGT Banks 115-116 (C520.2), Memory-SD_UHS_II (D32.2 J19.4)
SDCARD.RCLK_N: SMI Bank 12 (U1.AE25), Memory-SD_UHS_II (U39.8)
SDCARD.RCLK_P: SMI Bank 12 (U1.AD25), Memory-SD_UHS_II (U39.9)
SDCARD.VSEL: SMI Bank 12 (U1.AF22), Memory-SD_UHS_II (Q17.1 R344.1)
SDCARD.WP: SMI Bank 12 (U1.Y20), Memory-SD_UHS_II (D83.5 J19.21 R338.2)
SFP+_0_ACT: Bank 13_Bank 15_Bank 16 (U1.T25), SFP+_Connectors (R276.1)
SFP+_0_I2C_SCL: SFP+_Connectors (J2.5 R23.1), I2C Multiplexer (U22.8)
SFP+_0_I2C_SDA: SFP+_Connectors (J2.4 R22.1), I2C Multiplexer (U22.7)
SFP+_0_Link: Bank 13_Bank 15_Bank 16 (U1.T24), SFP+_Connectors (R275.1)
SFP+_0_LOS: Bank 13_Bank 15_Bank 16 (U1.T19), SFP+_Connectors (J2.8 R30.1)
SFP+_0_TX_EN: Bank 13_Bank 15_Bank 16 (U1.R18), SFP+_Connectors (Q1.1 R28.2)
SFP+_1_ACT: Bank 13_Bank 15_Bank 16 (U1.R23), SFP+_Connectors (R278.1)
SFP+_1_I2C_SCL: SFP+_Connectors (J3.5 R34.1), I2C Multiplexer (U22.11)
SFP+_1_I2C_SDA: SFP+_Connectors (J3.4 R33.1), I2C Multiplexer (U22.10)
SFP+_1_Link: Bank 13_Bank 15_Bank 16 (U1.T22), SFP+_Connectors (R277.1)
SFP+_1_LOS: Bank 13_Bank 15_Bank 16 (U1.M19), SFP+_Connectors (J3.8 R41.1)
SFP+_1_TX_EN: Bank 13_Bank 15_Bank 16 (U1.N18), SFP+_Connectors (Q2.1 R39.2)
SFP+_2_ACT: Bank 13_Bank 15_Bank 16 (U1.N21), SFP+_Connectors (R280.1)
SFP+_2_I2C_SCL: SFP+_Connectors (J4.5 R45.1), I2C Multiplexer (U22.13)
SFP+_2_I2C_SDA: SFP+_Connectors (J4.4 R44.1), I2C Multiplexer (U22.12)
SFP+_2_Link: Bank 13_Bank 15_Bank 16 (U1.N22), SFP+_Connectors (R279.1)
SFP+_2_LOS: Bank 13_Bank 15_Bank 16 (U1.R17), SFP+_Connectors (J4.8 R52.1)
SFP+_2_TX_EN: Bank 13_Bank 15_Bank 16 (U1.N17), SFP+_Connectors (Q3.1 R50.2)
SFP+_3_ACT: Bank 13_Bank 15_Bank 16 (U1.R22), SFP+_Connectors (R282.1)
SFP+_3_I2C_SCL: SFP+_Connectors (J5.5 R56.1), I2C Multiplexer (U22.15)
SFP+_3_I2C_SDA: SFP+_Connectors (J5.4 R55.1), I2C Multiplexer (U22.14)
SFP+_3_Link: Bank 13_Bank 15_Bank 16 (U1.R20), SFP+_Connectors (R281.1)
SFP+_3_LOS: Bank 13_Bank 15_Bank 16 (U1.R16), SFP+_Connectors (J5.8 R63.1)
SFP+_3_TX_EN: Bank 13_Bank 15_Bank 16 (U1.P16), SFP+_Connectors (Q4.1 R61.2)
SI5324~{_RST}_LS: SMI Bank 12 (U1.V22), System Clocks (U36.3)
SI5324_~{INIT}_LS: SMI Bank 12 (U1.V24), System Clocks (U24.3)
SI5324_REFCLK_N: MGT Banks 115-116 (R17.2 U1.K5), System Clocks (C192.2)
SI5324_REFCLK_P: MGT Banks 115-116 (R17.1 U1.K6), System Clocks (C190.2)
SI5324_SCL: I2C Multiplexer (U22.17), System Clocks (R209.1 U23.22)
SI5324_SDA: I2C Multiplexer (U22.16), System Clocks (R208.1 U23.23)
Switch_0: Bank 0_Bank 14 (U1.E25), HMI (R176.2 SW1.1)
Switch_1: Bank 0_Bank 14 (U1.E26), HMI (R177.2 SW1.2)
Switch_2: Bank 0_Bank 14 (U1.D25), HMI (R181.2 SW1.4)
Switch_3: Bank 0_Bank 14 (U1.C22), HMI (R182.2 SW1.8)
TEMP_I2C_SCL: SMI Bank 12 (Q6.3 R89.1), Power-Tree (TP20.1 U26.2 U27.2)
TEMP_I2C_SDA: SMI Bank 12 (Q5.3 R87.1), Power-Tree (TP19.1 U26.1 U27.1)
UART_USB_~{CTS}: Bank 0_Bank 14 (R113.2), Bank 13_Bank 15_Bank 16 (U1.F18)
UART_USB_~{RTS}: Bank 0_Bank 14 (R114.2), Bank 13_Bank 15_Bank 16 (U1.B17)
UART_USB_RxD: Bank 0_Bank 14 (R115.2), Bank 13_Bank 15_Bank 16 (U1.A17)
UART_USB_TxD: Bank 0_Bank 14 (R116.2), Bank 13_Bank 15_Bank 16 (U1.K15)
USER_LED_0: Bank 0_Bank 14 (U1.G21), HMI (R189.2)
USER_LED_1: Bank 0_Bank 14 (U1.J26), HMI (R190.2)
USER_LED_2: Bank 0_Bank 14 (U1.G26), HMI (R191.2)
USER_LED_3: Bank 0_Bank 14 (U1.H26), HMI (R192.2)
USER_LED_4: Bank 0_Bank 14 (U1.G25), HMI (R193.2)
USER_LED_5: Bank 0_Bank 14 (U1.F24), HMI (R194.2)
USER_LED_6: Bank 0_Bank 14 (U1.F25), HMI (R195.2)
USER_LED_7: Bank 0_Bank 14 (U1.G24), HMI (R196.2)
VSEL.ADJ1: Bank 13_Bank 15_Bank 16 (U1.T23), PSU_VCC_CRUVI_ADJ_Buck (Q16.1 R335.1)
VSEL.ADJ2: Bank 13_Bank 15_Bank 16 (U1.T20), PSU_VCC_CRUVI_ADJ_Buck (Q15.1 R334.1)
VSEL.ADJ3: Bank 13_Bank 15_Bank 16 (U1.U17), PSU_VCC_CRUVI_ADJ_Buck (Q14.1 R333.1)
VSEL.ADJ4: Bank 13_Bank 15_Bank 16 (U1.T18), PSU_VCC_CRUVI_ADJ_Buck (Q13.1 R332.1)

## Assembly variants
Full: all parts fitted
Standard: all parts fitted